# Altium schematic sheet Sensor_Board.SchDoc
size A3; CheckedBy: TEKNOFEST; SheetNumber: 2; SheetTotal: 3; Proje_Adı: Özgün Aviyonik Sistem; Takım_Adı: UZİNOVA SİGMA; Kategori: Yüksek İrtifa Roket Yarışması; PageSize: A3
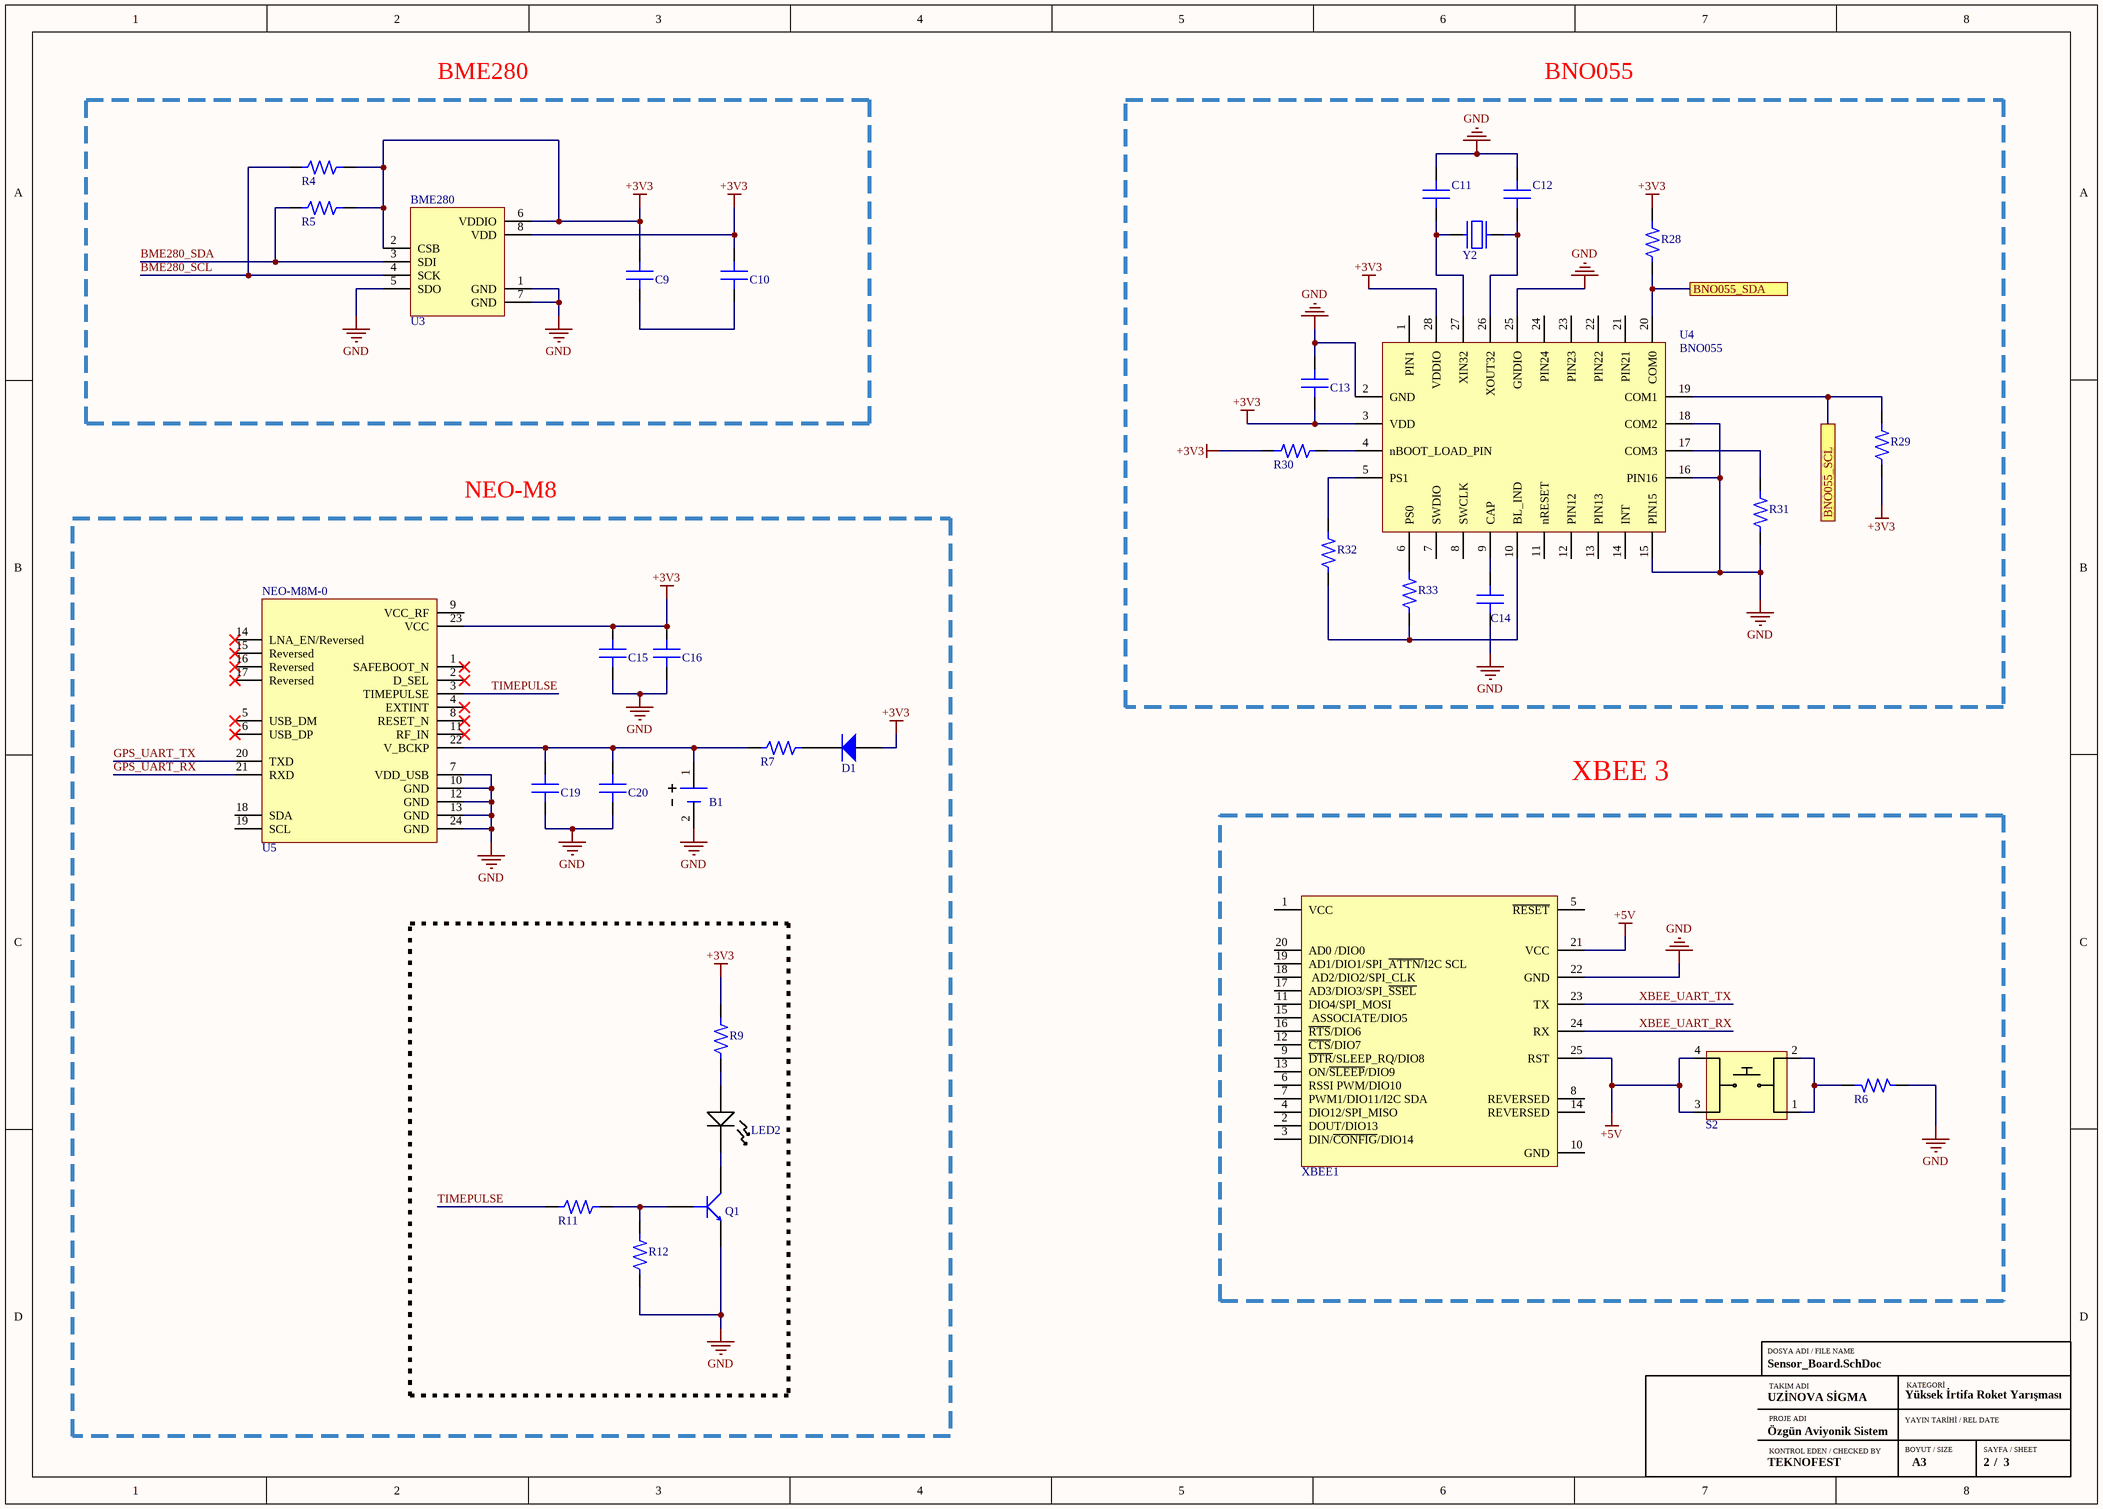
[diagram p0: Sensor_Board.SchDoc]

## Parts
B1  MS920SE-FL27E  [MS920SE_Battery]  (value not drawn)
C9  CAP CER 100nF 0805  [CAP_0805]  (value not drawn)
C10  CAP CER 100nF 0805  [CAP_0805]  (value not drawn)
C11  CAP CER 22pF 0805  [CAP_0805]  (value not drawn)
C12  CAP CER 22pF 0805  [CAP_0805]  (value not drawn)
C13  CAP CER 100nF 0805  [CAP_0805]  (value not drawn)
C14  CAP CER 1uF 0805  [CAP_0805]  (value not drawn)
C15  CAP CER 10uF 0805  [CAP_0805]  (value not drawn)
C16  CAP CER 100nF 0805  [CAP_0805]  (value not drawn)
C19  CAP CER 4.7uF 0805  [CAP_0805]  (value not drawn)
C20  CAP CER 100nF 0805  [CAP_0805]  (value not drawn)
D1  DIODE GEN PURP 75V 150MA SOD323F  [SOD323F]  (value not drawn)
LED2  CMD17-21VRD/TR8  [LED RED_0805]  (value not drawn)
Q1  MMBT3904-7-F  [SOT_23F]  (value not drawn)
R4  RES 4.7K OHM 0805  [RES_0805]  (value not drawn)
R5  RES 4.7K OHM 0805  [RES_0805]  (value not drawn)
R6  RES 10K OHM 0805  [RES_0805]  (value not drawn)
R7  RES 1K OHM 0805  [RES_0805]  (value not drawn)
R9  RES 1K OHM 0805  [RES_0805]  (value not drawn)
R11  RES 10K OHM 0805  [RES_0805]  (value not drawn)
R12  RES 10K OHM 0805  [RES_0805]  (value not drawn)
R28  RES 10K OHM 0805  [RES_0805]  (value not drawn)
R29  RES 10K OHM 0805  [RES_0805]  (value not drawn)
R30  RES 10K OHM 0805  [RES_0805]  (value not drawn)
R31  RES 10K OHM 0805  [RES_0805]  (value not drawn)
R32  RES 10K OHM 0805  [RES_0805]  (value not drawn)
R33  RES 10K OHM 0805  [RES_0805]  (value not drawn)
S2  PTS815 SJG 250 SMTR LFS  [BUTTON]  (value not drawn)
U3  BME280  [BME280]
U4  BNO055  [BNO055]
U5  NEO-M8M-0  [NEO-M8-GPS]
XBEE1  XB3-24Z8ST-J  [XBEE3]  (value not drawn)
Y2  CRYSTAL 32.7680KHZ 12.5PF SMD  [CRYSTAL_ABS05]  (value not drawn)

## Blocks framed on the sheet
BME280: C9 C10 R4 R5 U3
BNO055: C11-C14 R28-R33 U4 Y2
NEO-M8: B1 C15 C16 C19 C20 D1 LED2 Q1 R7 R9 R11 R12 U5

## Ports
BNO055_SCL, BNO055_SDA

## Nets
+3V3: C9.2 C10.2 C13.1 C15.2 C16.2 D1.2(ANODE) R4.2 R5.2 R9.2 R28.2 R29.1 R30.2 U3.2(CSB) U3.6(VDDIO) U3.8(VDD) U4.3(VDD) U4.28(VDDIO) U5.23(VCC)
+5V: S2.3 S2.4 XBEE1.21(VCC) XBEE1.25(RST)
GND: B1.2 C11.2 C12.2 C13.2 C14.1 C15.1 C16.1 C19.1 C20.1 Q1.2(E) R6.1 R12.1 R31.1 U3.1(GND) U3.5(SDO) U3.7(GND) U4.2(GND) U4.15(PIN15) U4.16(PIN16) U4.18(COM2) U4.25(GNDIO) U5.7(VDD_USB) U5.10(GND) U5.12(GND) U5.13(GND) U5.24(GND) XBEE1.22(GND)
BME280_SCL: R4.1 U3.4(SCK)
BME280_SDA: R5.1 U3.3(SDI)
BNO055_SCL: R29.2 U4.19(COM1) ; port BNO055_SCL
BNO055_SDA: R28.1 U4.20(COM0) ; port BNO055_SDA
GPS_UART_RX: U5.21(RXD)
GPS_UART_TX: U5.20(TXD)
TIMEPULSE: R11.1 U5.3(TIMEPULSE)
XBEE_UART_RX: XBEE1.24(RX)
XBEE_UART_TX: XBEE1.23(TX)
NetB1_1: B1.1 C19.2 C20.2 R7.1 U5.22(V_BCKP)
NetC9_1: C9.1 C10.1
NetC11_1: C11.1 U4.27(XIN32) Y2.1
NetC12_1: C12.1 U4.26(XOUT32) Y2.2
NetC14_2: C14.2 U4.9(CAP)
NetD1_1: D1.1(CATHODE) R7.2
NetLED2_1: LED2.1 R9.1
NetLED2_2: LED2.2 Q1.3(C)
NetQ1_1: Q1.1(B) R11.2 R12.2
NetR6_2: R6.2 S2.1 S2.2
NetR30_1: R30.1 U4.4(nBOOT_LOAD_PIN)
NetR31_2: R31.2 U4.17(COM3)
NetR32_1: R32.1 R33.1 U4.10(BL_IND)
NetR32_2: R32.2 U4.5(PS1)
NetR33_2: R33.2 U4.6(PS0)

Not connected (* = marked no-connect by the designer): U4 1(PIN1) 7(SWDIO) 8(SWCLK) 11(nRESET) 12(PIN12) 13(PIN13) 14(INT) 21(PIN21) 22(PIN22) 23(PIN23) 24(PIN24); U5 1(SAFEBOOT_N)* 2(D_SEL)* 4(EXTINT)* 5(USB_DM)* 6(USB_DP)* 8(RESET_N)* 9(VCC_RF) 11(RF_IN)* 14(LNA_EN/Reversed)* 15(Reversed)* 16(Reversed)* 17(Reversed)* 18(SDA) 19(SCL); XBEE1 1(VCC) 2(DOUT/DIO13) 3(DIN/~{CONFIG}/DIO14) 4(DIO12/SPI_MISO_) 5(~{RESET}) 6(RSSI_PWM/DIO10_) 7(PWM1/DIO11/I2C_SDA_) 8(REVERSED) 9(~{DTR}/SLEEP_RQ/DIO8) 10(GND) 11(DIO4/SPI_MOSI_) 12(~{CTS}/DIO7_) 13(ON/~{SLEEP}/DIO9) 14(REVERSED) 15(_ASSOCIATE/DIO5_) 16(~{RTS}/DIO6_) 17(AD3/DIO3/SPI_~{SSEL}_) 18(_AD2/DIO2/SPI_CLK) 19(AD1/DIO1/SPI_~{ATTN/}I2C_SCL) 20(AD0_/DIO0_)

## Notes on the sheet
- (near R4) SDO nun GND ye bağlanması sonucu slave adres 1110110(0x76) olur
- (near U5) USB İLE DEĞİL UART İLE HABERLEŞİYOR
- RF antenlerle ilgili olmalı?
- XBEE 3
- referanslardan biri
  https://europe1.discourse-cdn.com/arduino/original/4X/f/5/f/f5f21aaaef9b17e4257a80f31ce3023b1392f365.png
- (near U5) KULLANILACAK MI ? UART İÇİN RX-TX KULLANILIYOR..
- https://image.easyeda.com/components/a3499788020748ef87e202bcfc8d7515.png
- SORU İŞARETİ???
  XBEE İŞLEMCİYE GİTMEDEN ÖNCE KONNEKTÖRE GİDECEK
  İŞLEMCİ - USB - KONNEKTÖR
  acaba xbee den çıkan rx tx pinleri usb to uart yaptığımız ch340n den çıkan rx tx pinlerine mi gidecek????
- DOSYA ADI / FILE NAME
- TAKIM ADI
- KATEGORİ
- KONTROL EDEN / CHECKED BY
- PROJE ADI
- BOYUT / SIZE
- YAYIN TARİHİ / REL DATE
- SAYFA / SHEET
- /

## Library data of the parts
B1 = BATTERY: Lithium Battery Coin 3V 11mAh Rechargeable Tray; Manufacturer: Epson; Capacity: 0.011ah; Number of Cells: 1; Supplier 1: Digi-Key; Manufacturer Part Number: MS920SE-FL27E; RoHS: No; Stock 1: 17863; Pricing 1: 1=2,520000, 10=2,091000, 50=1,844000, 100=1,741000, 300=1,617400, 500=1,535000, 1000=1,452580, 2500=1,380470 (USD); Mount: Screw; Min Operating Temperature: -20°C; Max Operating Temperature: 60°C; Chemistry/Technology: Lithium; Voltage: 3V; ComponentLink1URL: http://speed.sii.co.jp/data/file_PRODUCT_MASTER_50112_TITLE_IMAGESP.pdf?src-supplier=Avnet; ComponentLink1Description: http://speed.sii.co.jp/data/file_PRODUCT_MASTER_50112_TITLE_IMAGESP.pdf?src-supplier=Avnet; Supplier Part Number 1: 728-1058-ND
D1 = DIODE: VR=75V IF=150mA Trr=4ns P=200mW; Manufacturer: ON Semiconductor / Fairchild; Manufacturer Part Number: 1N4148WS; Element Configuration: Single; Reverse Recovery Time: 4ns; Forward Voltage: 1V; Max Reverse Current: 5uA; Power Dissipation: 200mW; Max Forward Surge Current (Ifsm): 2A; Supplier 1: Digi-Key; RoHS: Yes; Category: Rectifier Diodes; Stock 1: 973654; Pricing 1: 1=0,21000, 10=0,19200, 100=0,10460, 500=0,06436, 1000=0,04388 (USD); Mount: Surface Mount; Number of Pins: 2; Contact Plating: Tin,Matte; Weight: 0.0276g; Min Operating Temperature: -55°C; Max Operating Temperature: 150°C; Packaging: Tape and Reel; Forward Current: 150mA; Max Repetitive Reverse Voltage (Vrrm): 75V; Package Quantity: 1; Average Rectified Current: 150mA; Max Reverse Voltage (DC): 75V; Recovery Time: 4ns; Series: -; Reverse Voltage: 75V; Length: 1.8mm; Width: 1.35mm; Height: 1mm; Radiation Hardening: No; RoHS Compliant: Yes; Lead Free: Lead Free; Reach SVHC Compliant: Yes; ComponentLink1URL: https://datasheet.ciiva.com/30479/0900766b810e1cd3-30479206.pdf?src-supplier=Rs; ComponentLink1Description: https://datasheet.ciiva.com/30479/0900766b810e1cd3-30479206.pdf?src-supplier=Rs; ComponentLink2URL: https://datasheet.ciiva.com/15208/getdatasheetpartid-127819-15208358.pdf?src-supplier=Verical; ComponentLink2Description: https://datasheet.ciiva.com/15208/getdatasheetpartid-127819-15208358.pdf?src-supplier=Verical; ComponentLink3URL: https://datasheet.ciiva.com/8300/1n914bws-8300360.pdf?src-supplier=Avnet; ComponentLink3Description: https://datasheet.ciiva.com/8300/1n914bws-8300360.pdf?src-supplier=Avnet; ComponentLink4URL: https://datasheet.ciiva.com/910/1n4148ws-910381.pdf?src-supplier=Digi-Key; ComponentLink4Description: https://datasheet.ciiva.com/910/1n4148ws-910381.pdf?src-supplier=Digi-Key; ComponentLink5URL: https://datasheet.ciiva.com/910/1n4148ws-910382.pdf?src-supplier=Digi-Key; ComponentLink5Description: https://datasheet.ciiva.com/910/1n4148ws-910382.pdf?src-supplier=Digi-Key; ComponentLink6URL: https://datasheet.ciiva.com/910/1n4148ws-910380.pdf?src-supplier=Digi-Key; ComponentLink6Description: https://datasheet.ciiva.com/910/1n4148ws-910380.pdf?src-supplier=Digi-Key; Supplier Part Number 1: 1N4148WSFSDKR-ND
LED2 = LED RED: LED Uni-Color Red 640nm 2-Pin SMT T/R; Manufacturer: VCC CHML; Power Rating: 100mW; Luminous Intensity: 6mcd; Viewing Angle: 140°; Lens Style: Diffused,Tinted,Rectangular,Colored; Forward Current: 20mA; Forward Voltage: 2V; Reverse Voltage (DC): 5V; Number of LEDs: 1; Supplier 1: Digi-Key; Manufacturer Part Number: CMD17-21VRD/TR8; RoHS: Yes; Category: LEDs; Stock 1: 357228; Pricing 1: 1=0,73000, 10=0,47800, 100=0,31310, 1000=0,24720 (USD); Mount: Surface Mount; Case/Package: 0805; Number of Pins: 2; Color: Red; Case Code (Metric): 2012; Case Code (Imperial): 0805; Lens Color: Red; Min Operating Temperature: -40°C; Max Operating Temperature: 85°C; Packaging: Tape and Reel; Package Quantity: 1; Illumination Color: Red; Test Current: 20mA; Wavelength: 640nm; Reverse Voltage: 5V; Length: 2mm; Width: 1.25mm; Height: 1.1mm; RoHS Compliant: Yes; Lead Free: Lead Free; ComponentLink1URL: http://www.mouser.com/ds/2/423/CMD1721ver1-1064576.pdf?src-supplier=Mouser; ComponentLink1Description: http://www.mouser.com/ds/2/423/CMD1721ver1-1064576.pdf?src-supplier=Mouser; ComponentLink2URL: https://www.alliedelec.com/m/d/ea8f758becbd32522d2612194452bcae.pdf?src-supplier=Allied+Electronics; ComponentLink2Description: https://www.alliedelec.com/m/d/ea8f758becbd32522d2612194452bcae.pdf?src-supplier=Allied+Electronics; ComponentLink3URL: http://www.onlinecomponents.com/productFiles/mf-CM/2cmd17-21seriessmtleds0805packagesize.pdf?src-supplier=Onlinecomponents.com; ComponentLink3Description: http://www.onlinecomponents.com/productFiles/mf-CM/2cmd17-21seriessmtleds0805packagesize.pdf?src-supplier=Onlinecomponents.com; ComponentLink4URL: https://vcclite.com/wp-content/uploads/wpallimport/files/files/CMD1721Seriesver3.pdf?src-supplier=Digi-Key; ComponentLink4Description: https://vcclite.com/wp-content/uploads/wpallimport/files/files/CMD1721Seriesver3.pdf?src-supplier=Digi-Key; Supplier Part Number 1: L62501CT-ND
Q1 = BJT_NPN: NPN Ic=200mA Vceo=40V hfe=100~300 fT=310MHz P=300mW SOT-23; Manufacturer: Diodes Zetex; Max Power Dissipation: 300mW; Collector Emitter Voltage (VCEO): 40V; Max Collector Current: 200mA; Collector Base Voltage (VCBO): 60V; Power Dissipation: 350mW; Frequency: 300MHz; hFE Min: 100; Number of Elements: 1; Emitter Base Voltage (VEBO): 6V; Collector Emitter Saturation Voltage: 300mV; Element Configuration: Single; Supplier 1: Digi-Key; Manufacturer Part Number: MMBT3904-7-F; RoHS: Yes; Category: BJTs; Stock 1: 7729144; Pricing 1: 1=0,13000, 10=0,11700, 100=0,06370, 500=0,03918, 1000=0,02671 (USD); Mount: Surface Mount; Case/Package: SOT-23; Number of Pins: 3; Weight: 0.000282oz; Contact Plating: Tin,Matte; Min Operating Temperature: -55°C; Max Operating Temperature: 150°C; Polarity: NPN; Packaging: Tape and Reel; Package Quantity: 3000; Transition Frequency: 300MHz; Collector Emitter Breakdown Voltage: 40V; Max Breakdown Voltage: 40V; Continuous Collector Current: 200mA; Max Frequency: 300MHz; Gain Bandwidth Product: 300MHz; Voltage Rating (DC): 40V; Series: Automotive, AEC-Q101; Collector-emitter Voltage-Max: 300mV; Length: 3.05mm; Width: 1.4mm; Height: 1mm; Radiation Hardening: No; Reach SVHC Compliant: Yes; Lead Free: Lead Free; RoHS Compliant: Yes; ComponentLink1URL: https://datasheet.ciiva.com/11201/ds30036-11201778.pdf?src-supplier=Avnet; ComponentLink1Description: https://datasheet.ciiva.com/11201/ds30036-11201778.pdf?src-supplier=Avnet; ComponentLink2URL: https://datasheet.ciiva.com/15138/getdatasheetpartid-53265-15138780.pdf?src-supplier=Verical; ComponentLink2Description: https://datasheet.ciiva.com/15138/getdatasheetpartid-53265-15138780.pdf?src-supplier=Verical; ComponentLink3URL: https://datasheet.ciiva.com/22711/1915516-22711750.pdf?src-supplier=Element14; ComponentLink3Description: https://datasheet.ciiva.com/22711/1915516-22711750.pdf?src-supplier=Element14; ComponentLink4URL: https://datasheet.ciiva.com/11198/ds30036-11198999.pdf?src-supplier=Avnet; ComponentLink4Description: https://datasheet.ciiva.com/11198/ds30036-11198999.pdf?src-supplier=Avnet; ComponentLink5URL: https://datasheet.ciiva.com/6361/ds30036-6361256.pdf?src-supplier=Digi-Key; ComponentLink5Description: https://datasheet.ciiva.com/6361/ds30036-6361256.pdf?src-supplier=Digi-Key; ComponentLink6URL: https://datasheet.ciiva.com/6361/ds30036-6361254.pdf?src-supplier=Digi-Key; ComponentLink6Description: https://datasheet.ciiva.com/6361/ds30036-6361254.pdf?src-supplier=Digi-Key; Supplier Part Number 1: MMBT3904-FDICT-ND
S2 = BUTTON: Switch Tactile N.O. SPST Button J-Bend 0.05A 12VDC 3.92N SMD T/R; Manufacturer: ITT C&K; Supplier 1: Digi-Key; Manufacturer Part Number: PTS815SJG250SMTRLFS; RoHS: Yes; Category: Tactile Switches; Stock 1: 47215; Pricing 1: 1=0,22000, 10=0,21400, 25=0,20280, 100=0,18360, 250=0,16736, 500=0,15558, 1000=0,13271 (USD); Supplier Part Number 1: CKN12217-1-ND
U3 = BME280: Pressure, Temperature and Humidity Sensor Digital Output 1.8V 8-Pin LGA T/R; Manufacturer: Bosch Tools; Supplier 1: Digi-Key; Manufacturer Part Number: BME280; RoHS: No; Category: Pressure Sensors; Stock 1: 180730; Pricing 1: 1=7,64000, 5=6,74200, 10=5,95500, 25=4,83160, 50=4,26960, 100=4,15730, 500=3,48316, 1000=3,25844 (USD); Supplier Part Number 1: 828-1063-1-ND
U4 = BNO055: BNO055 Series 1.7 to 3.6 V Intelligent 9-Axis Absolute Orientation Sensor-LGA-28; Manufacturer: Bosch; Sensor Type: Accelerometer,Gyroscope,Magnetometer,3 Axis; Output Type: I2C; Supplier 1: Future Electronics; Manufacturer Part Number: BNO055; RoHS: No; Category: Inertial Measurement Units (IMUs); Pricing 1: 4000=7,70000 (USD); Mount: Surface Mount; Case/Package: LGA; Min Operating Temperature: -40°C; Max Operating Temperature: 85°C; Packaging: Tape and Reel; Lead Free: Lead Free; ComponentLink1URL: https://ae-bst.resource.bosch.com/media/_tech/media/application_notes/BST-BNO055-HS000.pdf ?src-supplier=Digi-Key; ComponentLink1Description: https://ae-bst.resource.bosch.com/media/_tech/media/application_notes/BST-BNO055-HS000.pdf ?src-supplier=Digi-Key; Supplier Part Number 1: 8159159
U5 = NEO-M8: Rf Rcvr Gnss/gps 1.575GHZ 24LCC; Manufacturer: u-blox; Interface: I2C,SPI,USB,UART; Sensitivity: -167dBm; Current - Receiving: 21mA; Supplier 1: Digi-Key; Manufacturer Part Number: NEO-M8M-0; RoHS: Yes; Category: RF Receivers, Transceivers; Stock 1: 3000; Pricing 1: 1=27,00000, 10=19,61000, 50=16,10000, 100=12,89000 (USD); Case/Package: SMD/SMT; Min Operating Temperature: -40°C; Max Operating Temperature: 85°C; Packaging: Tape and Reel; Frequency: 1.575GHz; ComponentLink1URL: https://www.u-blox.com/sites/default/files/products/documents/NEO-M8-FW3_ProductSummary_%28UBX-16000345%29.pdf?src-supplier=Digi-Key; ComponentLink1Description: https://www.u-blox.com/sites/default/files/products/documents/NEO-M8-FW3_ProductSummary_%28UBX-16000345%29.pdf?src-supplier=Digi-Key; ComponentLink2URL: https://www.u-blox.com/sites/default/files/NEO-M8-FW3_DataSheet_%28UBX-15031086%29.pdf?src-supplier=Digi-Key; ComponentLink2Description: https://www.u-blox.com/sites/default/files/NEO-M8-FW3_DataSheet_%28UBX-15031086%29.pdf?src-supplier=Digi-Key; Supplier Part Number 1: 672-NEO-M8M-0CT-ND
XBEE1 = XBEE3: Zigbee Module, 2.4 Ghz, Sma Ant, Th Mt Rohs Compliant: Yes; Manufacturer: Digi International; Interface: I2C,SPI,UART; Frequency: 2.4GHz; Data Rate: 250Kbps; Sensitivity: -103dBm; Memory Size: 128KB; Current - Receiving: 15mA; Current - Transmitting: 40mA; Supplier 1: Digi-Key; Manufacturer Part Number: XB3-24Z8ST-J; RoHS: Yes; Category: RF Receivers, Transceivers; Pricing 1: 1=26,38000 (USD); Mount: Through Hole; Case/Package: Module; Min Operating Temperature: -40°C; Max Operating Temperature: 85°C; Packaging: Tray; ComponentLink1URL: https://www.digi.com/pdf/ds_xbee-3-zigbee-3.pdf?src-supplier=Digi-Key; ComponentLink1Description: https://www.digi.com/pdf/ds_xbee-3-zigbee-3.pdf?src-supplier=Digi-Key; Supplier Part Number 1: 602-2186-ND
Y2 = CRYSTAL: Crystal 0.032768MHz ±20ppm (Tol) 12.5pF Flexural 90000Ohm 2-Pin CSMD T/R; Manufacturer: Abracon; Manufacturer Part Number: ABS05-32.768KHZ-T; Frequency: 32.768kHz; ESR (Equivalent Series Resistance): 90kR; Operating Frequency: 32.768 kHz; Supplier 1: Digi-Key; RoHS: Yes; Category: Crystals; Stock 1: 376220; Pricing 1: 1=0,66000, 10=0,58100, 50=0,54340, 100=0,48020, 500=0,45494, 1000=0,37911 (USD); Mount: Surface Mount; Case/Package: CSMD; Number of Pins: 2; Min Operating Temperature: -40°C; Max Operating Temperature: 85°C; Packaging: Tape and Reel; Frequency Tolerance: 20ppm; Load Capacitance: 12.5pF; Package Quantity: 3000; Tolerance: 20ppm; Termination: SMD/SMT; Series Resistance: 90kR; Series: ABS05; Length: 1.6mm; Width: 1mm; Height: 0.5mm; Depth: 1mm; Radiation Hardening: No; Reach SVHC Compliant: Yes; Lead Free: Lead Free; RoHS Compliant: Yes; ComponentLink1URL: https://datasheet.ciiva.com/23810/abs05-23810480.pdf?src-supplier=Newark; ComponentLink1Description: https://datasheet.ciiva.com/23810/abs05-23810480.pdf?src-supplier=Newark; ComponentLink2URL: https://datasheet.ciiva.com/6728/abs05-6728949.pdf?src-supplier=Digi-Key; ComponentLink2Description: https://datasheet.ciiva.com/6728/abs05-6728949.pdf?src-supplier=Digi-Key; ComponentLink3URL: https://datasheet.ciiva.com/6728/abs05-6728950.pdf?src-supplier=Digi-Key; ComponentLink3Description: https://datasheet.ciiva.com/6728/abs05-6728950.pdf?src-supplier=Digi-Key; ComponentLink4URL: https://datasheet.ciiva.com/16411/abs05-16411149.pdf?src-supplier=Future+Electronics; ComponentLink4Description: https://datasheet.ciiva.com/16411/abs05-16411149.pdf?src-supplier=Future+Electronics; Supplier Part Number 1: 535-11899-1-ND